# Altium schematic sheet CT Main.SchDoc
size A3
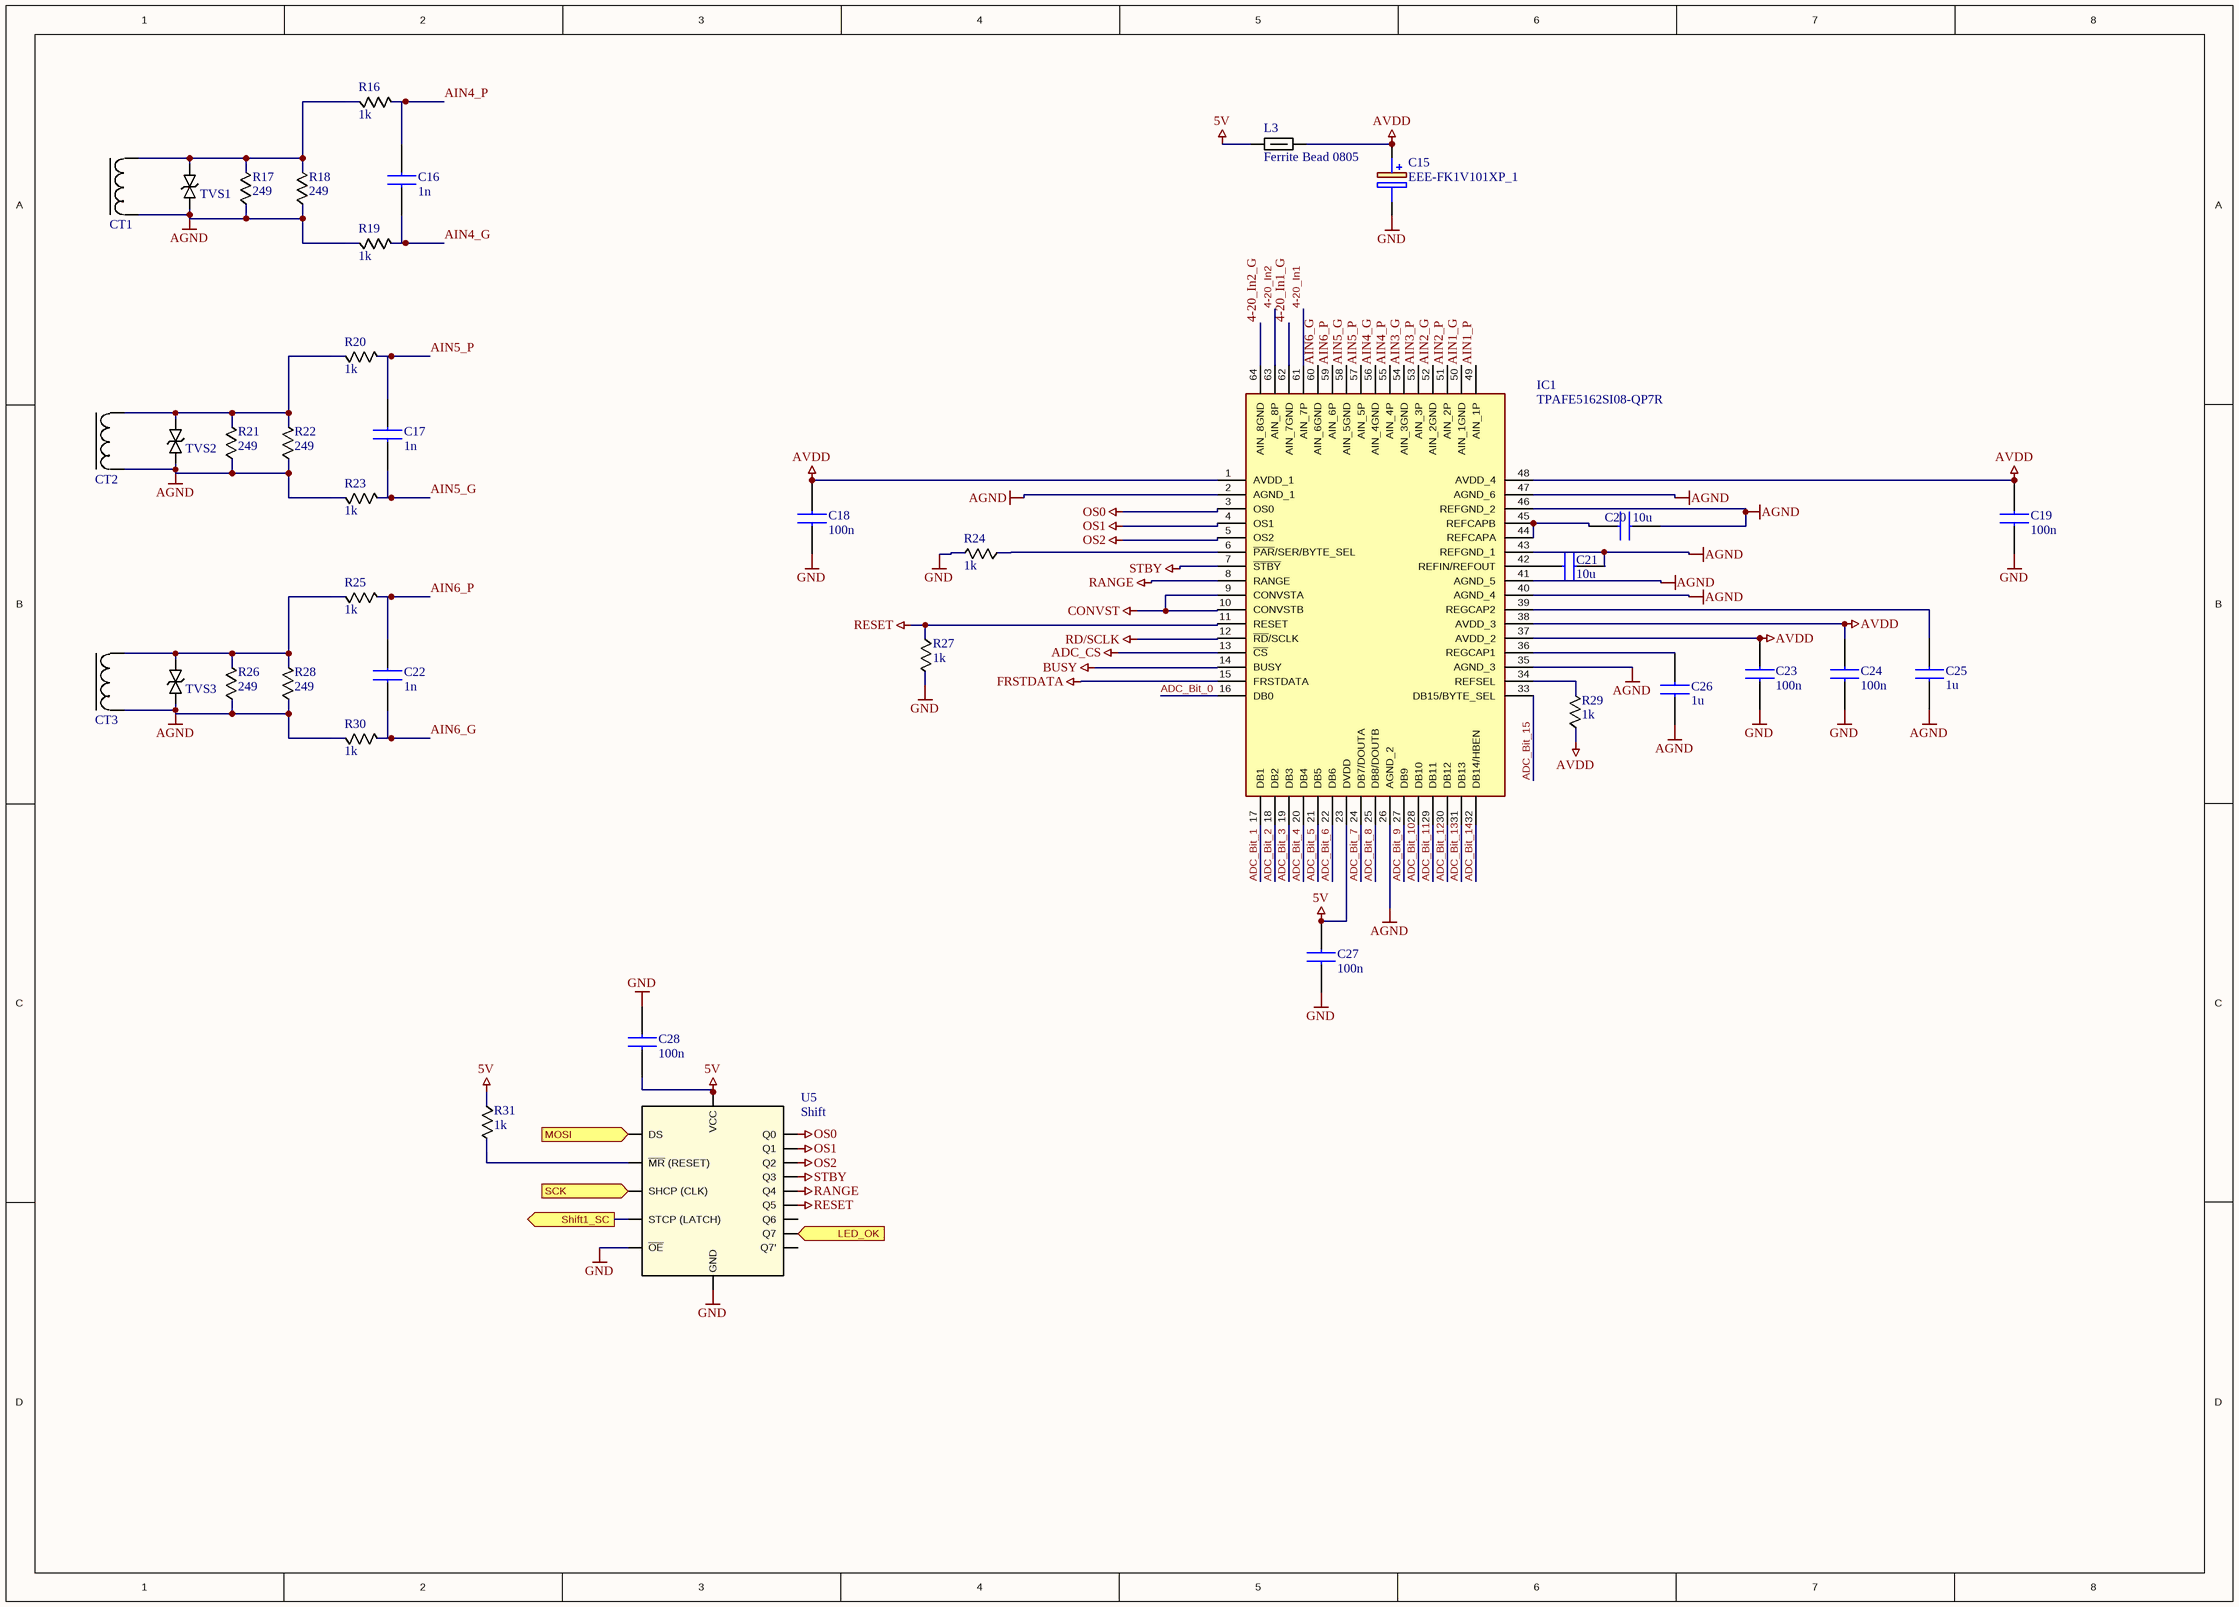
[diagram p0: CT Main.SchDoc]

## Parts
C15  EEE-FK1V101XP_1  [EEE1AA220WR]
C16  1n  [0603 CAP]
C17  1n  [0603 CAP]
C18  100n  [0603 CAP]
C19  100n  [0603 CAP]
C20  10u  [0603 CAP]
C21  10u  [0603 CAP]
C22  1n  [0603 CAP]
C23  100n  [0603 CAP]
C24  100n  [0603 CAP]
C25  1u  [0603 CAP]
C26  1u  [0603 CAP]
C27  100n  [0603 CAP]
C28  100n  [0603 CAP]
CT1  Current Transformer  [Talema AC1005]  (value not drawn)
CT2  Current Transformer  [Talema AC1005]  (value not drawn)
CT3  Current Transformer  [Talema AC1005]  (value not drawn)
IC1  TPAFE5162SI08-QP7R  [QFP50P1200X1200X160-64N]
L3  Ferrite Bead 0805  [BLM21AG102BH1J]
R16  1k  [0603 CAP]
R17  249  [1206 Res Kelvin]
R18  249  [1206 Res Kelvin]
R19  1k  [0603 CAP]
R20  1k  [0603 CAP]
R21  249  [1206 Res Kelvin]
R22  249  [1206 Res Kelvin]
R23  1k  [0603 CAP]
R24  1k  [0603 CAP]
R25  1k  [0603 CAP]
R26  249  [1206 Res Kelvin]
R27  1k  [0603 CAP]
R28  249  [1206 Res Kelvin]
R29  1k  [0603 CAP]
R30  1k  [0603 CAP]
R31  1k  [0603 CAP]
TVS1  TVS Diode  [DO-214AC / SMA]  (value not drawn)
TVS2  TVS Diode  [DO-214AC / SMA]  (value not drawn)
TVS3  TVS Diode  [DO-214AC / SMA]  (value not drawn)
U5  Shift  [SOIC16]

## Ports
LED_OK, MOSI, SCK, Shift1_SC

## Nets
5V: C27.2 C28.1 IC1.23(DVDD) L3.1 R31.1 U5.16(VCC)
ADC_CS: IC1.13(~{CS})
AGND: C20.1 C21.1 C25.1 C26.1 CT1.2 CT2.2 CT3.2 IC1.2(AGND_1) IC1.26(AGND_2) IC1.35(AGND_3) IC1.40(AGND_4) IC1.41(AGND_5) IC1.43(REFGND_1) IC1.46(REFGND_2) IC1.47(AGND_6) R17.1 R18.1 R19.1 R21.1 R22.1 R23.1 R26.1 R28.1 R30.1 TVS1.1 TVS2.1 TVS3.1
AVDD: C15.1(+) C18.2 C19.2 C23.2 C24.2 IC1.1(AVDD_1) IC1.37(AVDD_2) IC1.38(AVDD_3) IC1.48(AVDD_4) L3.2 R29.1
BUSY: IC1.14(BUSY)
CONVST: IC1.9(CONVSTA) IC1.10(CONVSTB)
FRSTDATA: IC1.15(FRSTDATA)
GND: C15.2(-) C18.1 C19.1 C23.1 C24.1 C27.1 C28.2 R24.2 R27.2 U5.8(GND) U5.13(~{OE})
OS0: IC1.3(OS0) U5.15(Q0)
OS1: IC1.4(OS1) U5.1(Q1)
OS2: IC1.5(OS2) U5.2(Q2)
RANGE: IC1.8(RANGE) U5.4(Q4)
RD/SCLK: IC1.12(~{RD}/SCLK)
RESET: IC1.11(RESET) R27.1 U5.5(Q5)
STBY: IC1.7(~{STBY}) U5.3(Q3)
4-20_In1: IC1.61(AIN_7P)
4-20_In1_G: IC1.62(AIN_7GND)
4-20_In2: IC1.63(AIN_8P)
4-20_In2_G: IC1.64(AIN_8GND)
ADC_Bit_0: IC1.16(DB0)
ADC_Bit_1: IC1.17(DB1)
ADC_Bit_2: IC1.18(DB2)
ADC_Bit_3: IC1.19(DB3)
ADC_Bit_4: IC1.20(DB4)
ADC_Bit_5: IC1.21(DB5)
ADC_Bit_6: IC1.22(DB6)
ADC_Bit_7: IC1.24(DB7/DOUTA)
ADC_Bit_8: IC1.25(DB8/DOUTB)
ADC_Bit_9: IC1.27(DB9)
ADC_Bit_10: IC1.28(DB10)
ADC_Bit_11: IC1.29(DB11)
ADC_Bit_12: IC1.30(DB12)
ADC_Bit_13: IC1.31(DB13)
ADC_Bit_14: IC1.32(DB14/HBEN)
ADC_Bit_15: IC1.33(DB15/BYTE_SEL)
AIN1_G: IC1.50(AIN_1GND)
AIN1_P: IC1.49(AIN_1P)
AIN2_G: IC1.52(AIN_2GND)
AIN2_P: IC1.51(AIN_2P)
AIN3_G: IC1.54(AIN_3GND)
AIN3_P: IC1.53(AIN_3P)
AIN4_G: C16.2 IC1.56(AIN_4GND) R19.2
AIN4_P: C16.1 IC1.55(AIN_4P) R16.2
AIN5_G: C17.2 IC1.58(AIN_5GND) R23.2
AIN5_P: C17.1 IC1.57(AIN_5P) R20.2
AIN6_G: C22.2 IC1.60(AIN_6GND) R30.2
AIN6_P: C22.1 IC1.59(AIN_6P) R25.2
LED_OK: U5.7(Q7) ; port LED_OK
MOSI: U5.14(DS) ; port MOSI
SCK: U5.11(SHCP_(CLK)) ; port SCK
Shift1_SC: U5.12(STCP_(LATCH)) ; port Shift1_SC
NetC20_2: C20.2 IC1.44(REFCAPA) IC1.45(REFCAPB)
NetC21_2: C21.2 IC1.42(REFIN/REFOUT)
NetC25_2: C25.2 IC1.39(REGCAP2)
NetC26_2: C26.2 IC1.36(REGCAP1)
NetCT1_1: CT1.1 R16.1 R17.2 R18.2 TVS1.2
NetCT2_1: CT2.1 R20.1 R21.2 R22.2 TVS2.2
NetCT3_1: CT3.1 R25.1 R26.2 R28.2 TVS3.2
NetIC1_6: IC1.6(~{PAR}/SER/BYTE_SEL) R24.1
NetIC1_34: IC1.34(REFSEL) R29.2
NetR31_2: R31.2 U5.10(~{MR}_(RESET))

Not connected (* = marked no-connect by the designer): U5 6(Q6) 9(Q7')

## Library data of the parts
C15 = EEE-FK1V101XP_1: EEEFK1C100R; Manufacturer_Name: Panasonic; Datasheet Link: http://industrial.panasonic.com/cdbs/www-data/pdf/RDE0000/ABA0000C1181.pdf; Height: 7.8mm; Manufacturer_Part_Number: EEE-FK1V101XP; Mouser Part Number: 667-EEE-FK1V101XP; Mouser Price/Stock: https://www.mouser.co.uk/ProductDetail/Panasonic/EEE-FK1V101XP?qs=qE6bgDGEOCu46KIpIgG5Yw%3D%3D; Arrow Part Number: EEE-FK1V101XP; Arrow Price/Stock: https://www.arrow.com/en/products/eee-fk1v101xp/panasonic?utm_currency=USD&region=europe
C16 C17 C22 = 0603 CAP: GRM188R72A102KA01D; Manufacturer_Name: Murata Electronics; Manufacturer_Part_Number: GRM188R72A103KA01D; Datasheet Link: https://search.murata.co.jp/Ceramy/image/img/A01X/G101/ENG/GRM188R72A103KA01-01A.pdf; Height: 0.9mm; Mouser Part Number: 81-GRM188R72A103KA1D; Mouser Price/Stock: https://www.mouser.co.uk/ProductDetail/Murata-Electronics/GRM188R72A103KA01D?qs=krk%2F6UQjCzAtl9phuocbug%3D%3D; Arrow Part Number: GRM188R72A103KA01D; Arrow Price/Stock: https://www.arrow.com/en/products/grm188r72a103ka01d/murata-manufacturing?region=europe
C18 C19 C23 C24 C27 C28 = 0603 CAP: CC0603KRX7R9BB104; Manufacturer_Name: Murata Electronics; Manufacturer_Part_Number: GRM188R72A103KA01D; Datasheet Link: https://search.murata.co.jp/Ceramy/image/img/A01X/G101/ENG/GRM188R72A103KA01-01A.pdf; Height: 0.9mm; Mouser Part Number: 81-GRM188R72A103KA1D; Mouser Price/Stock: https://www.mouser.co.uk/ProductDetail/Murata-Electronics/GRM188R72A103KA01D?qs=krk%2F6UQjCzAtl9phuocbug%3D%3D; Arrow Part Number: GRM188R72A103KA01D; Arrow Price/Stock: https://www.arrow.com/en/products/grm188r72a103ka01d/murata-manufacturing?region=europe
C20 C21 = 0603 CAP: GRM188R61E105KA12D; Manufacturer_Name: Murata Electronics; Manufacturer_Part_Number: GRM188R72A103KA01D; Datasheet Link: https://search.murata.co.jp/Ceramy/image/img/A01X/G101/ENG/GRM188R72A103KA01-01A.pdf; Height: 0.9mm; Mouser Part Number: 81-GRM188R72A103KA1D; Mouser Price/Stock: https://www.mouser.co.uk/ProductDetail/Murata-Electronics/GRM188R72A103KA01D?qs=krk%2F6UQjCzAtl9phuocbug%3D%3D; Arrow Part Number: GRM188R72A103KA01D; Arrow Price/Stock: https://www.arrow.com/en/products/grm188r72a103ka01d/murata-manufacturing?region=europe
C25 C26 = 0603 CAP: CC0603KRX5R7BB105; Manufacturer_Name: Murata Electronics; Manufacturer_Part_Number: GRM188R72A103KA01D; Datasheet Link: https://search.murata.co.jp/Ceramy/image/img/A01X/G101/ENG/GRM188R72A103KA01-01A.pdf; Height: 0.9mm; Mouser Part Number: 81-GRM188R72A103KA1D; Mouser Price/Stock: https://www.mouser.co.uk/ProductDetail/Murata-Electronics/GRM188R72A103KA01D?qs=krk%2F6UQjCzAtl9phuocbug%3D%3D; Arrow Part Number: GRM188R72A103KA01D; Arrow Price/Stock: https://www.arrow.com/en/products/grm188r72a103ka01d/murata-manufacturing?region=europe
CT1-CT3 = Talema AC1005: AC-1005
IC1 = TPAFE5162SI08-QP7R: TPAFE5162; Manufacturer_Name: 3Peak Incorporated; Datasheet Link: https://static.3peak.com/res/doc/ds/Datasheet_TPAFE5162.pdf; Height: 1.6mm; Manufacturer_Part_Number: TPAFE5162SI08-QP7R
L3 = Ferrite Bead
R16 R19 R20 R23-R25 R27 R29-R31 = 0603 RES
R17 R18 R21 R22 R26 R28 = RES 1206: RT1206BRD07249RL
TVS1-TVS3 = TVS: TVS Protective Diode
U5 = 74HC595: SN74HC595DR